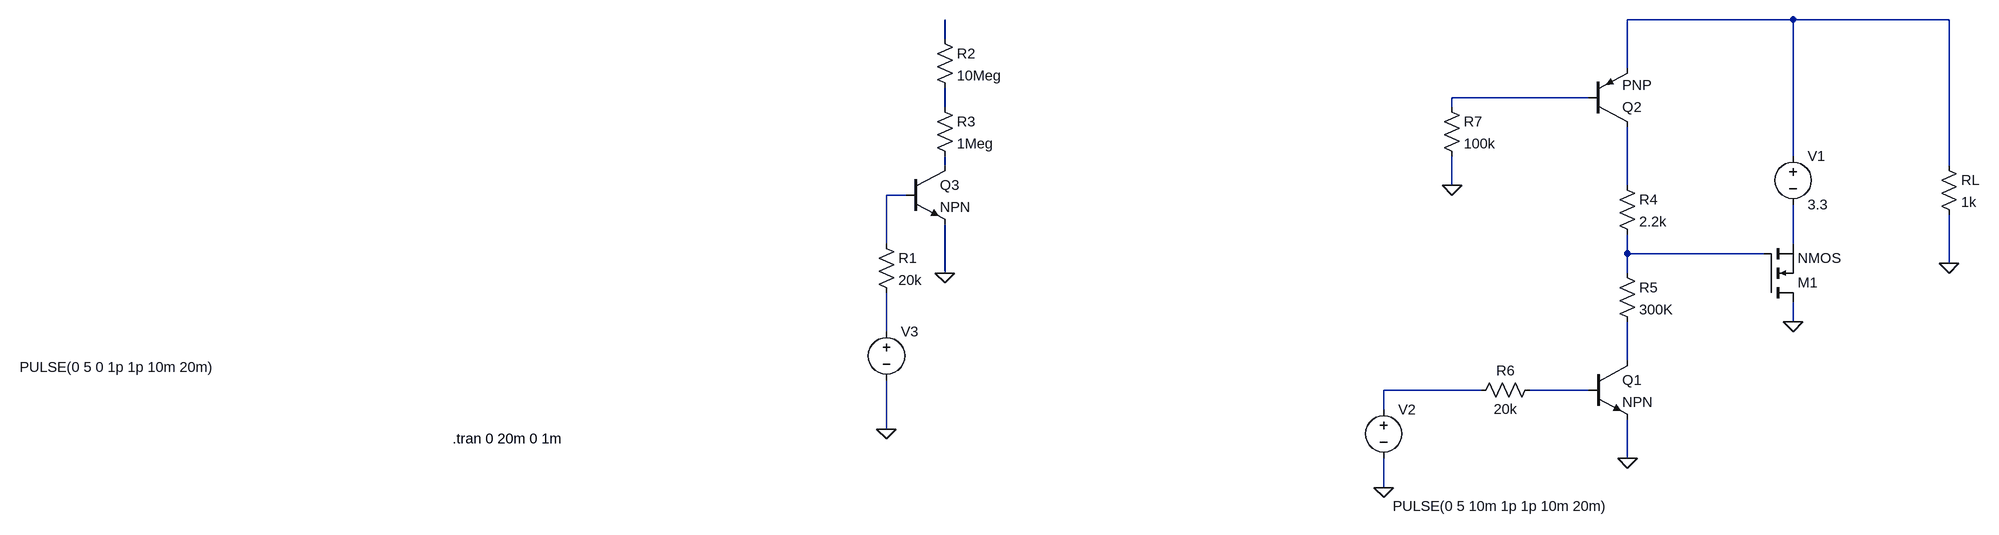
[diagram p0: schematic Draft1.asc]
Draft1.asc, the LTspice schematic file:
Version 4.1
SHEET 1 880 832
WIRE 160 -192 -112 -192
WIRE 416 -192 160 -192
WIRE -1232 -160 -1232 -192
WIRE -112 -112 -112 -192
WIRE -176 -64 -400 -64
WIRE -1232 -48 -1232 -80
WIRE -400 -48 -400 -64
WIRE 160 32 160 -192
WIRE -1232 48 -1232 32
WIRE 416 48 416 -192
WIRE -400 80 -400 32
WIRE -112 80 -112 -16
WIRE -1296 96 -1328 96
WIRE -1328 176 -1328 96
WIRE 160 176 160 112
WIRE -112 192 -112 160
WIRE 112 192 -112 192
WIRE 416 208 416 128
WIRE -1232 224 -1232 144
WIRE -112 224 -112 192
WIRE 160 304 160 272
WIRE -1328 320 -1328 256
WIRE -112 368 -112 304
WIRE -352 416 -512 416
WIRE -176 416 -272 416
WIRE -512 448 -512 416
WIRE -1328 480 -1328 400
WIRE -112 528 -112 464
WIRE -512 576 -512 528
FLAG 160 304 0
FLAG 416 208 0
FLAG -112 528 0
FLAG -512 576 0
FLAG -1232 224 0
FLAG -1328 480 0
FLAG -400 80 0
SYMBOL nmos 112 272 M180
SYMATTR InstName M1
SYMBOL res 400 32 R0
SYMATTR InstName RL
SYMATTR Value 1k
SYMBOL npn -176 368 R0
SYMATTR InstName Q1
SYMBOL res -128 208 R0
SYMATTR InstName R5
SYMATTR Value 300K
SYMBOL voltage -512 432 R0
WINDOW 3 15 175 Left 2
WINDOW 123 0 0 Left 0
WINDOW 39 0 0 Left 0
SYMATTR InstName V2
SYMATTR Value PULSE(0 5 10m 1p 1p 10m 20m)
SYMBOL res -128 64 R0
SYMATTR InstName R4
SYMATTR Value 2.2k
SYMBOL npn -1296 48 R0
SYMATTR InstName Q3
SYMBOL res -1248 -64 R0
SYMATTR InstName R3
SYMATTR Value 1Meg
SYMBOL res -1248 -176 R0
SYMATTR InstName R2
SYMATTR Value 10Meg
SYMBOL res -1344 160 R0
SYMATTR InstName R1
SYMATTR Value 20k
SYMBOL voltage -1328 304 R0
WINDOW 3 -1423 75 Left 2
WINDOW 123 0 0 Left 0
WINDOW 39 0 0 Left 0
SYMATTR InstName V3
SYMATTR Value PULSE(0 5 0 1p 1p 10m 20m)
SYMBOL res -256 400 R90
WINDOW 0 0 56 VBottom 2
WINDOW 3 32 56 VTop 2
SYMATTR InstName R6
SYMATTR Value 20k
SYMBOL voltage 160 16 R0
WINDOW 123 0 0 Left 0
WINDOW 39 0 0 Left 0
SYMATTR InstName V1
SYMATTR Value 3.3
SYMBOL res -416 -64 R0
SYMATTR InstName R7
SYMATTR Value 100k
SYMBOL pnp -176 -16 M180
SYMATTR InstName Q2
TEXT -2040 496 Left 2 !.tran 0 20m 0 1m

The netlist it stands for:
* Draft1.asc
M1 0 N009 N008 N008 NMOS
RL N001 0 1k
Q1 N011 N013 0 0 NPN
R5 N009 N011 300K
V2 N012 0 PULSE(0 5 10m 1p 1p 10m 20m)
R4 N006 N009 2.2k
Q3 N005 N007 0 0 NPN
R3 N004 N005 1Meg
R2 N002 N004 10Meg
R1 N007 N010 20k
V3 N010 0 PULSE(0 5 0 1p 1p 10m 20m)
R6 N013 N012 20k
V1 N001 N008 3.3
R7 N003 0 100k
Q2 N006 N003 N001 0 PNP
.model NPN NPN
.model PNP PNP
.lib standard.bjt
.model NMOS NMOS
.model PMOS PMOS
.lib standard.mos
.tran 0 20m 0 1m
.backanno
.end